# Altium schematic sheet [08] - MAIN CONNECTOR.SchDoc: X
size A4; Date: DD-MM-YYYY; CheckedBy: X; DrawnBy: Y; Revision: 0.0.0; SheetNumber: X; SheetTotal: Y; Projectnumber: OWN-000; Size: A4; Contact: datasystem.pl; Projectname: X
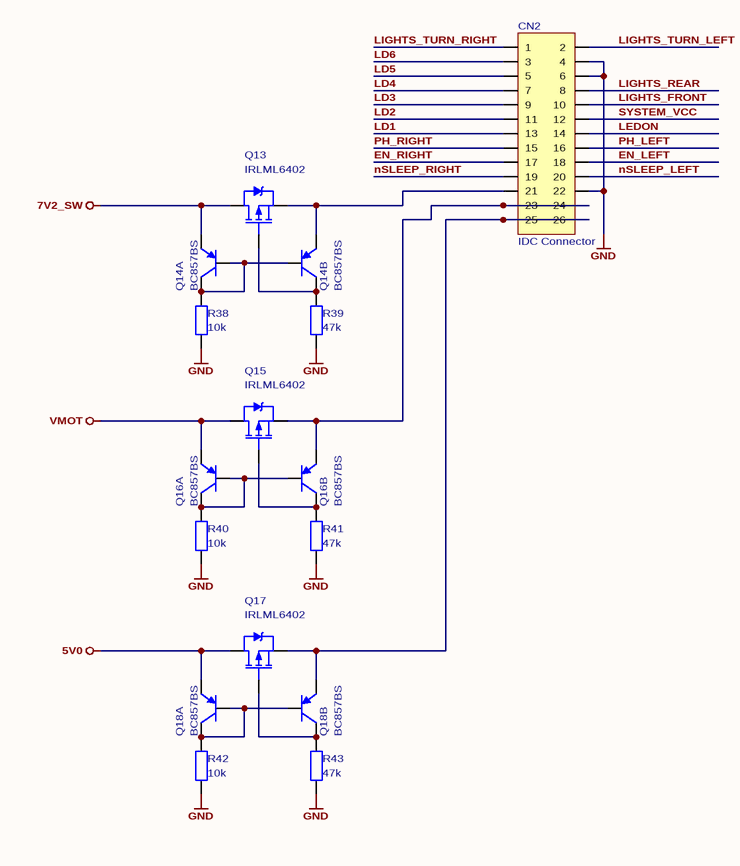
[diagram p0: [08] - MAIN CONNECTOR.SchDoc]

## Parts
CN2  IDC Connector  [IDC26_RA_LONG_W_CN]
Q13  IRLML6402  [SOT-23]
Q14  BC857BS  [SOT-323-6 (SOT-363, SC88, SC70-6)]  (parts A,B of 2)
Q15  IRLML6402  [SOT-23]
Q16  BC857BS  [SOT-323-6 (SOT-363, SC88, SC70-6)]  (parts A,B of 2)
Q17  IRLML6402  [SOT-23]
Q18  BC857BS  [SOT-323-6 (SOT-363, SC88, SC70-6)]  (parts A,B of 2)
R38  10k  [R0805]
R39  47k  [R0805]
R40  10k  [R0805]
R41  47k  [R0805]
R42  10k  [R0805]
R43  47k  [R0805]

## Nets
5V0: Q17.3(D) Q18.1(EA)
7V2_SW: Q13.3(D) Q14.1(EA)
GND: CN2.4 CN2.6 CN2.22 R38.1 R39.1 R40.1 R41.1 R42.1 R43.1
VMOT: Q15.3(D) Q16.1(EA)
EN_LEFT: CN2.18
EN_RIGHT: CN2.17
LD1: CN2.13
LD2: CN2.11
LD3: CN2.9
LD4: CN2.7
LD5: CN2.5
LD6: CN2.3
LEDON: CN2.14
LIGHTS_FRONT: CN2.10
LIGHTS_REAR: CN2.8
LIGHTS_TURN_LEFT: CN2.2
LIGHTS_TURN_RIGHT: CN2.1
nSLEEP_LEFT: CN2.20
nSLEEP_RIGHT: CN2.19
PH_LEFT: CN2.16
PH_RIGHT: CN2.15
SYSTEM_VCC: CN2.12
NetCN2_21: CN2.21 Q13.2(S) Q14.4(EB)
NetCN2_23: CN2.23 CN2.24 Q15.2(S) Q16.4(EB)
NetCN2_25: CN2.25 CN2.26 Q17.2(S) Q18.4(EB)
NetQ13_1: Q13.1(G) Q14.3(CB) R39.2
NetQ14_2: Q14.2(BA) Q14.5(BB) Q14.6(CA) R38.2
NetQ15_1: Q15.1(G) Q16.3(CB) R41.2
NetQ16_2: Q16.2(BA) Q16.5(BB) Q16.6(CA) R40.2
NetQ17_1: Q17.1(G) Q18.3(CB) R43.2
NetQ18_2: Q18.2(BA) Q18.5(BB) Q18.6(CA) R42.2

## Notes on the sheet
- REV:
- A  P  P  R  O  V  E  D
- /
- Lodz University of Technology
- ul. Wolczanska 211/215
- 90-924 LODZ, POLAND
- Institute of Electronics
- Project name:
- Title:
- Author:
- Verified by:

## Library data of the parts
CN2 = CN_13x2
Q13 Q15 Q17 = IRLML6402: P-Channel; -20V, -3.7A, 1.3W; HEXFET Power MOS-FET
Q14 Q16 Q18 = BC857BS: 2xPNP General Purpose Transistor (VCE=-45V, IC=-100mA)
R38-R43 = Res: Resistor; Published: 19-Feb-2006; ComponentLink1Description: datasheet; ComponentLink2Description: supplier
  R38 R40 R42: Value: 10k
  R39 R41 R43: Value: 47k